# Altium schematic sheet ADC_USB.SchDoc
size A4
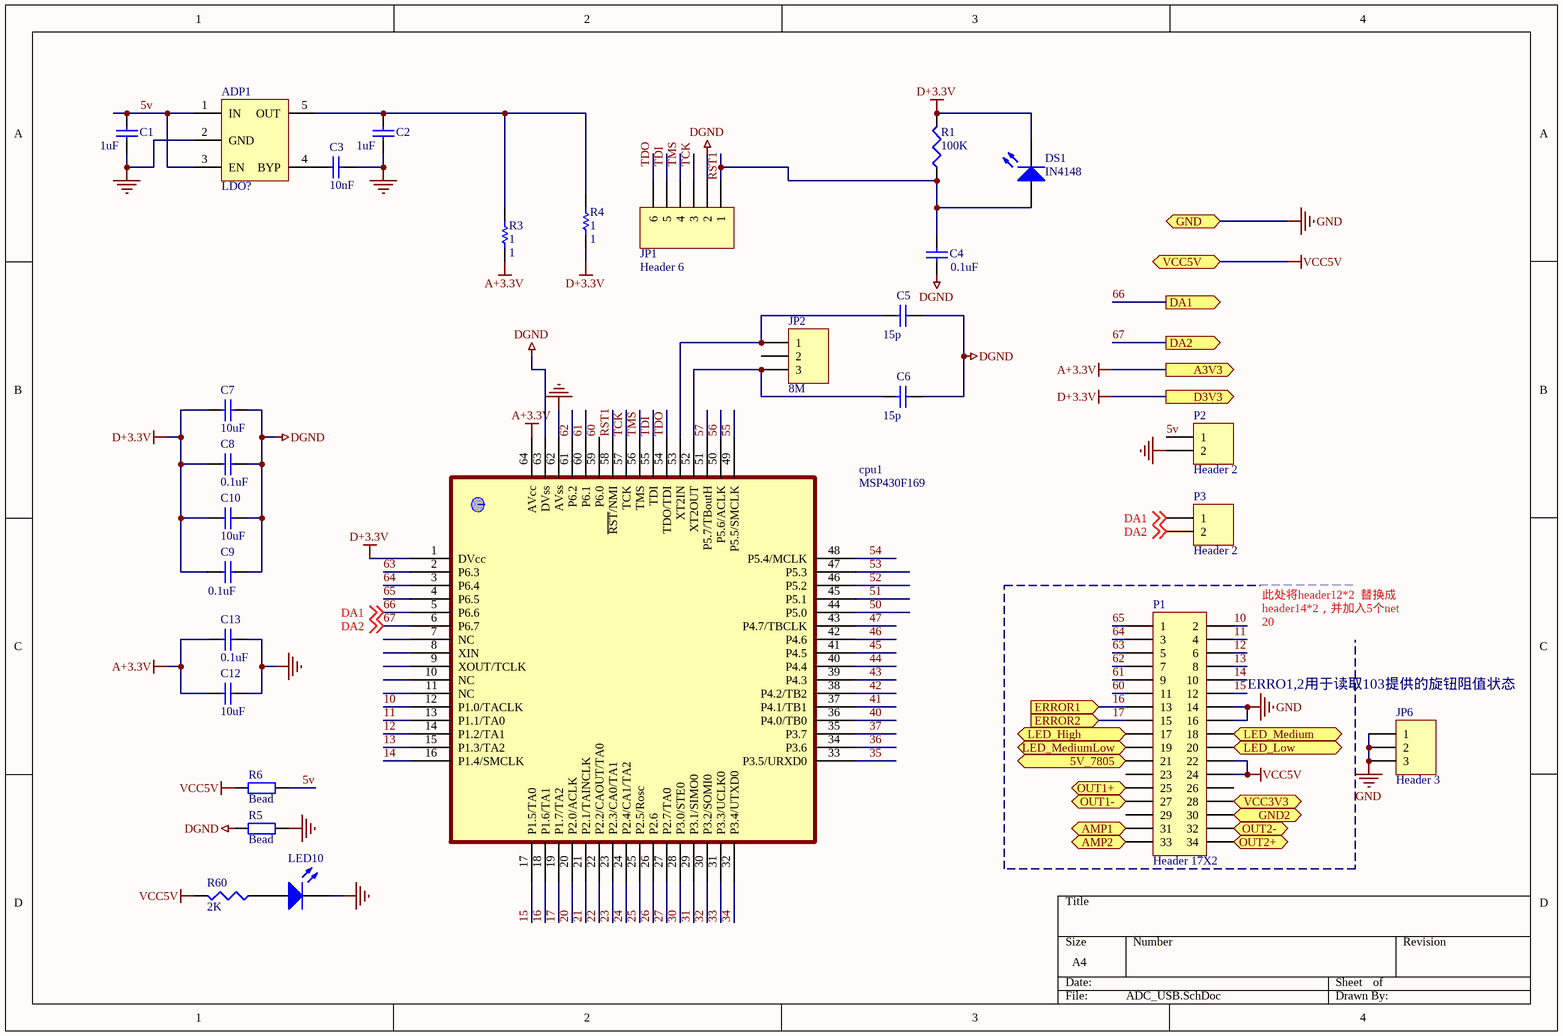
[diagram p0: ADC_USB.SchDoc]

## Parts
ADP1  LDO?  [ADP1711_3v3]
C1  value 1uF  [CC1608-0603]  (hidden comment: 1u)
C2  value 1uF  [CC1608-0603]  (hidden comment: 1u)
C3  value 10nF  [CC1608-0603]  (hidden comment: 10n)
C4  0.1uF  [CC1608-0603]
C5  15p  [CC1608-0603]
C6  15p  [CC1608-0603]
C7  10uF  [CC3216-1206]
C8  value 0.1uF  [CC1608-0603]  (hidden comment: Cap Semi)
C9  0.1uF  [CC1608-0603]
C10  10uF  [CC3216-1206]
C12  10uF  [CC3216-1206]
C13  0.1uF  [CC1608-0603]
cpu1  MSP430F169  [msp430f149]
DS1  IN4148  [SMD _LED]
JP1  Header 6  [HDR1X6]
JP2  8M  [HDR1X3]
JP6  Header 3  [HDR1X3]
LED10  LED  [6-0805_M]  (value not drawn)
P1  Header 17X2  [HDR2X17-NIUJIAO]
P2  Header 2  [HDR1X2]
P3  Header 2  [HDR1X2]
R1  100K  [C1608-0603]
R3  1  [6-0805_M]
R4  1  [6-0805_M]
R5  Bead  [6-0805_M]
R6  Bead  [6-0805_M]
R60  2K  [1608[0603]]

## Blocks framed on the sheet
ERRO1,2用于读取103提供的旋钮阻值状态: P1

## Ports
5V_7805 (in), A3V3 (out), AMP1, AMP2, D3V3 (out), DA1 (out), DA2 (out), ERROR1 (in), ERROR2 (in), GND, GND2 (in), LED_High (in), LED_Low (in), LED_Medium (in), LED_MediumLow (in), OUT1+ (in), OUT1- (in), OUT2+ (in), OUT2- (in), VCC3V3 (in), VCC5V

## Nets
A+3.3V: C12.2 C13.2 cpu1.64(AVcc) R3.1 ; port A3V3
D+3.3V: C7.2 C8.2 C9.2 C10.2 cpu1.1(DVcc) DS1.2(K) R1.2 R4.1 ; port D3V3
DGND: C4.1 C5.1 C6.1 C7.1 C8.1 C9.1 C10.1 cpu1.63(DVss) JP1.2 R5.1
GND: ADP1.2(GND) C1.2 C2.2 C3.2 C12.1 C13.1 cpu1.62(AVss) JP6.1 JP6.2 JP6.3 LED10.2(K) P1.14 P1.16 P2.2 R5.2 ; port GND
VCC5V: P1.22 P1.24 R6.2 R60.2 ; port VCC5V
5v: ADP1.1(IN) ADP1.3(EN) C1.1 P2.1 R6.1
5V_7805: P1.21 ; port 5V_7805
10: cpu1.12(P1.0/TACLK) P1.2
11: cpu1.13(P1.1/TA0) P1.4
12: cpu1.14(P1.2/TA1) P1.6
13: cpu1.15(P1.3/TA2) P1.8
14: cpu1.16(P1.4/SMCLK) P1.10
15: cpu1.17(P1.5/TA0) P1.12
16: cpu1.18(P1.6/TA1) P1.13 ; port ERROR1
17: cpu1.19(P1.7/TA2) P1.15 ; port ERROR2
20: cpu1.20(P2.0/ACLK)
21: cpu1.21(P2.1/TAINCLK)
22: cpu1.22(P2.2/CAOUT/TA0)
23: cpu1.23(P2.3/CA0/TA1)
24: cpu1.24(P2.4/CA1/TA2)
25: cpu1.25(P2.5/Rosc)
26: cpu1.26(P2.6)
27: cpu1.27(P2.7/TA0)
30: cpu1.28(P3.0/STE0)
31: cpu1.29(P3.1/SIMO0)
32: cpu1.30(P3.2/SOMI0)
33: cpu1.31(P3.3/UCLK0)
34: cpu1.32(P3.4/UTXD0)
35: cpu1.33(P3.5/URXD0)
36: cpu1.34(P3.6)
37: cpu1.35(P3.7)
40: cpu1.36(P4.0/TB0)
41: cpu1.37(P4.1/TB1)
42: cpu1.38(P4.2/TB2)
43: cpu1.39(P4.3)
44: cpu1.40(P4.4)
45: cpu1.41(P4.5)
46: cpu1.42(P4.6)
47: cpu1.43(P4.7/TBCLK)
50: cpu1.44(P5.0)
51: cpu1.45(P5.1)
52: cpu1.46(P5.2)
53: cpu1.47(P5.3)
54: cpu1.48(P5.4/MCLK)
55: cpu1.49(P5.5/SMCLK)
56: cpu1.50(P5.6/ACLK)
57: cpu1.51(P5.7/TBoutH)
60: cpu1.59(P6.0) P1.11
61: cpu1.60(P6.1) P1.9
62: cpu1.61(P6.2) P1.7
63: cpu1.2(P6.3) P1.5
64: cpu1.3(P6.4) P1.3
65: cpu1.4(P6.5) P1.1
66: cpu1.5(P6.6) P3.1 ; off-sheet DA1, port DA1  [also labelled DA1]
67: cpu1.6(P6.7) P3.2 ; off-sheet DA2, port DA2  [also labelled DA2]
AMP1: P1.31 ; port AMP1
AMP2: P1.33 ; port AMP2
GND2: P1.30 ; port GND2
LED_High: P1.17 ; port LED_High
LED_Low: P1.20 ; port LED_Low
LED_Medium: P1.18 ; port LED_Medium
LED_MediumLow: P1.19 ; port LED_MediumLow
OUT1+: P1.25 ; port OUT1+
OUT1-: P1.27 ; port OUT1-
OUT2+: P1.34 ; port OUT2+
OUT2-: P1.32 ; port OUT2-
RST1: C4.2 cpu1.58(~{RST}/NMI) DS1.1(A) JP1.1 R1.1
TCK: cpu1.57(TCK) JP1.3
TDI: cpu1.55(TDI) JP1.5
TDO: cpu1.54(TDO/TDI) JP1.6
TMS: cpu1.56(TMS) JP1.4
VCC3V3: P1.28 ; port VCC3V3
NetADP1_4: ADP1.4(BYP) C3.1
NetADP1_5: ADP1.5(OUT) C2.1 R3.2 R4.2
NetC5_2: C5.2 cpu1.53(XT2IN) JP2.1
NetC6_2: C6.2 cpu1.52(XT2OUT) JP2.3
NetLED10_1: LED10.1(A) R60.1

Not connected (* = marked no-connect by the designer): cpu1 7(NC) 8(XIN) 9(XOUT/TCLK) 10(NC) 11(NC); JP2 2; P1 23 26 29

## Notes on the sheet
- 此处将header12*2  替换成header14*2，并加入5个net
  20

## Library data of the parts
ADP1 = ADP1711_3v3
C1-C10 C12 C13 = Cap Semi: Capacitor (Semiconductor SIM Model); Published: 8-Jun-2000; Revision: July-2002: Re-released for DXP Platform.; Publisher: Altium Limited
  C4 C9 C13: Value: 0.1uF
  C5 C6: Value: 15p
  C7 C10 C12: Value: 10uF
cpu1 = MSP430F149
DS1 LED10 = LED3: Typical BLUE SiC LED; Revision 1: Jul-2002: Re-released for DXP Platform.; Revision 2: 17-Dec-2003: PCB Footprint replaced.; Published: 8-Jun-2000; Publisher: Altium Limited
JP1 = Header 6: Header, 6-Pin; LatestRevisionDate: 17-Jul-2002; LatestRevisionNote: Re-released for DXP Platform.; Publisher: Altium Limited
JP2 JP6 = Header 3: Header, 3-Pin; Revision: 17-Jul-2002: Re-released for DXP Platform.; Publisher: Altium Limited
P1 = Header 17X2: Header, 17-Pin, Dual row; LatestRevisionDate: 17-Jul-2002; LatestRevisionNote: Re-released for DXP Platform.; Publisher: Altium Limited
P2 P3 = Header 2: Header, 2-Pin; LatestRevisionDate: 17-Jul-2002; LatestRevisionNote: Re-released for DXP Platform.; Publisher: Altium Limited
R1 R60 = Res3: Resistor; Published: 8-Jun-2000; Revision: July-2002: Re-released for DXP Platform.; Publisher: Altium Limited
  R1: Value: 100K
  R60: Value: 2K
R3 R4 = Res Semi: Semiconductor Resistor; Published: 8-Jun-2000; LatestRevisionDate: 17-Jul-2002; LatestRevisionNote: Re-released for DXP Platform.; PackageReference: AXIAL-0.5; Publisher: Altium Limited; Value: 1
R5 R6 = Res2: Resistor; Value: 1K; Published: 8-Jun-2000; Revision: July-2002: Re-released for DXP Platform.; Publisher: Altium Limited